# Altium schematic sheet VoltageSense.SchDoc
size A; SheetNumber: 5; SheetTotal: 5
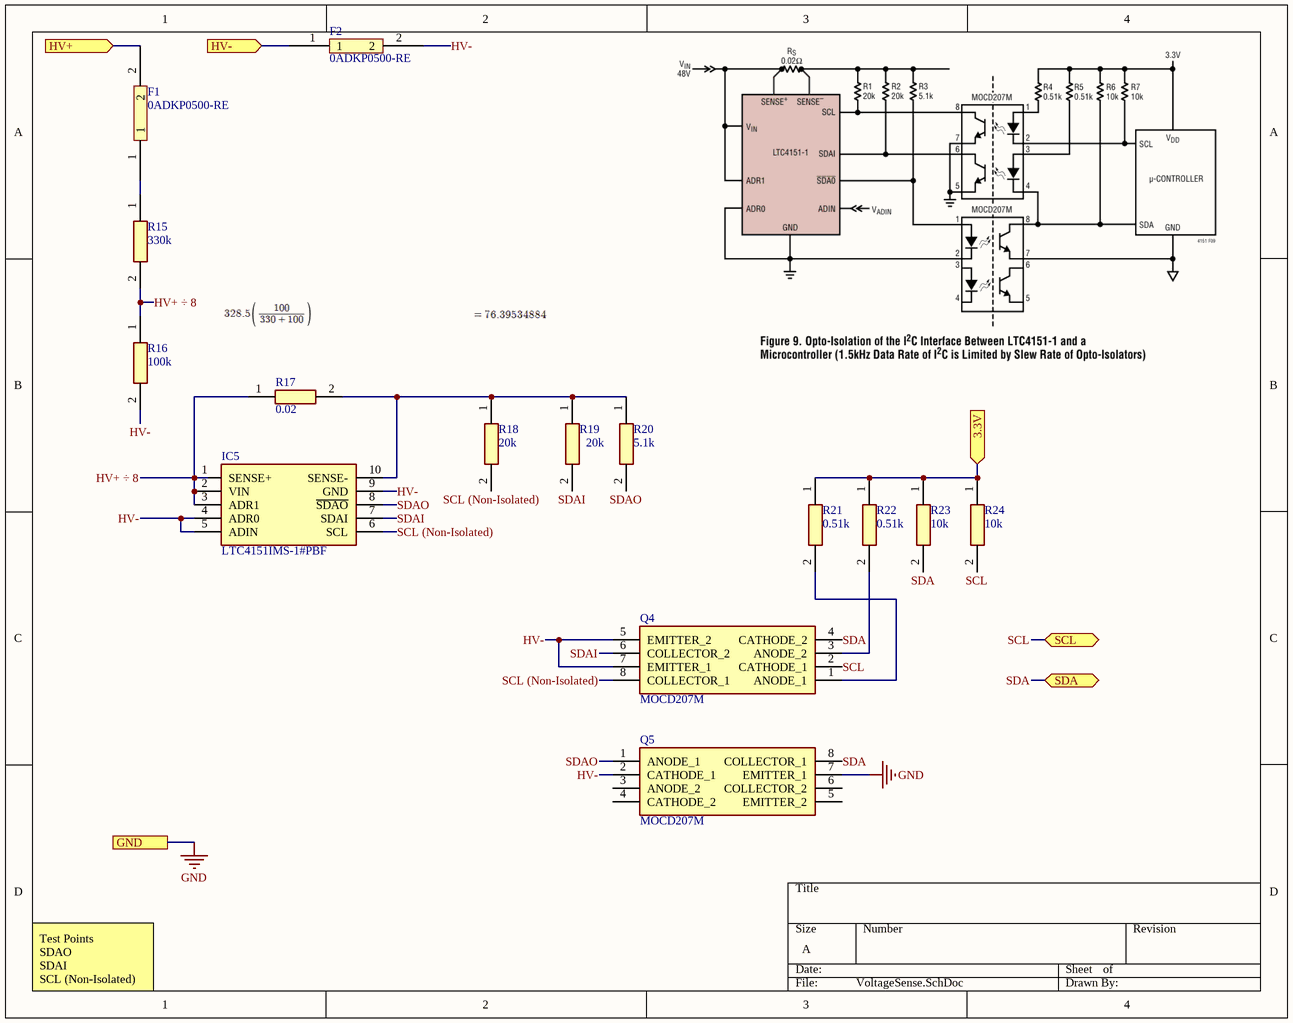
[diagram p0: VoltageSense.SchDoc]

## Parts
F1  0ADKP0500-RE  [0ADKP0500-RE]
F2  0ADKP0500-RE  [0ADKP0500-RE]
IC5  LTC4151IMS-1#PBF  [SOP50P490X110-10N]
Q4  MOCD207M  [SOIC127P594X363-8N]
Q5  MOCD207M  [SOIC127P594X363-8N]
R15  330k  [ERJP08_(1206)]
R16  100k  [RESC3216X65N]
R17  0.02  [RESC3216X68N]
R18  20k  [RESC3216X70N]
R19  20k  [RESC3216X70N]
R20  5.1k  [RESC3116X65N]
R21  0.51k  [RESC3216X65N]
R22  0.51k  [RESC3216X65N]
R23  10k  [ERJP08_(1206)]
R24  10k  [ERJP08_(1206)]

## Ports
3.3V (in), GND, HV+ (in), HV- (in), SCL (bidir), SDA (bidir)

## Nets
GND: Q5.7(EMITTER_1) ; port GND
3.3V: R21.1 R22.1 R23.1 R24.1 ; port 3.3V
HV+: F1.2 ; port HV+
HV+ ÷ 8: IC5.1(SENSE+) IC5.2(VIN) IC5.3(ADR1) R15.2 R16.1 R17.1
HV-: F2.2 IC5.4(ADR0) IC5.5(ADIN) IC5.9(GND) Q4.5(EMITTER_2) Q4.7(EMITTER_1) Q5.2(CATHODE_1) R16.2
HV-: F2.1 ; port HV-  [a separate net that carries the same name]
SCL: Q4.2(CATHODE_1) R24.2 ; port SCL
SCL (Non-Isolated): IC5.6(SCL) Q4.8(COLLECTOR_1) R18.2
SDA: Q4.4(CATHODE_2) Q5.8(COLLECTOR_1) R23.2 ; port SDA
SDAI: IC5.7(SDAI) Q4.6(COLLECTOR_2) R19.2
SDAO: IC5.8(~{SDAO}) Q5.1(ANODE_1) R20.2
NetF1_1: F1.1 R15.1
NetIC5_10: IC5.10(SENSE-) R17.2 R18.1 R19.1 R20.1
NetQ4_1: Q4.1(ANODE_1) R21.2
NetQ4_3: Q4.3(ANODE_2) R22.2

Not connected (* = marked no-connect by the designer): Q5 3(ANODE_2) 4(CATHODE_2) 5(EMITTER_2) 6(COLLECTOR_2)

## Notes on the sheet
- Test Points
  SDAO
  SDAI
  SCL (Non-Isolated)

## Library data of the parts
F1 F2 = 0ADKP0500-RE: Fuse
IC5 = LTC4151IMS-1#PBF: Integrated Circuit; Manufacturer_Name: Analog Devices; Datasheet Link: https://www.analog.com/media/en/technical-documentation/data-sheets/4151ff.pdf; Height: 1.1mm; Manufacturer_Part_Number: LTC4151IMS-1#PBF; Mouser Part Number: 584-LTC4151IMS-1#PBF; Mouser Price/Stock: https://www.mouser.co.uk/ProductDetail/Analog-Devices/LTC4151IMS-1PBF?qs=hVkxg5c3xu8GkocOuUpsIw%3D%3D; Arrow Part Number: LTC4151IMS-1#PBF; Arrow Price/Stock: https://www.arrow.com/en/products/ltc4151ims-1pbf/linear-technology
Q4 Q5 = MOCD207M: Transistor; Manufacturer_Name: onsemi; Datasheet Link: https://www.onsemi.com/pub/Collateral/MOCD217M-D.PDF; Height: 3.63mm; Manufacturer_Part_Number: MOCD207M; Mouser Part Number: 512-MOCD207M; Mouser Price/Stock: https://www.mouser.co.uk/ProductDetail/onsemi-Fairchild/MOCD207M?qs=Z0HAwyWrFkxA8A7IbmLQiA%3D%3D; Arrow Part Number: MOCD207M; Arrow Price/Stock: https://www.arrow.com/en/products/mocd207m/on-semiconductor?region=europe
R15 = ERJ-P08D3303V: Resistor; Manufacturer_Name: Panasonic; Datasheet Link: http://industrial.panasonic.com/cdbs/www-data/pdf/RDO0000/AOA0000C331.pdf; Height: 0.7mm; Manufacturer_Part_Number: ERJ-P08D3303V
R16 = MCA12060C1003FP500: Resistor; Manufacturer_Name: Vishay; Datasheet Link: https://componentsearchengine.com/Datasheets/1/MCA12060C1003FP500.pdf; Height: 0.65mm; Manufacturer_Part_Number: MCA12060C1003FP500; Mouser Part Number: 594-MCA12060C1003FP5; Mouser Price/Stock: https://www.mouser.com/Search/Refine.aspx?Keyword=594-MCA12060C1003FP5
R17 = PCS1206DR0200ET: Resistor; Manufacturer_Name: Ohmite; Datasheet Link: https://componentsearchengine.com/Datasheets/1/PCS1206DR0200ET.pdf; Height: 0.684mm; Manufacturer_Part_Number: PCS1206DR0200ET; Mouser Part Number: 588-PCS1206DR0200ET; Mouser Price/Stock: https://www.mouser.co.uk/ProductDetail/Ohmite/PCS1206DR0200ET?qs=Zz7%252BYVVL6bHe1REzh6xp%2Fw%3D%3D
R18 R19 = ERA-8APB203V: Resistor; Manufacturer_Name: Panasonic; Datasheet Link: https://industrial.panasonic.com/cdbs/www-data/pdf/RDM0000/AOA0000C307.pdf; Height: 0.7mm; Manufacturer_Part_Number: ERA-8APB203V; Mouser Part Number: 667-ERA-8APB203V; Mouser Price/Stock: https://www.mouser.co.uk/ProductDetail/Panasonic/ERA-8APB203V?qs=PgLP5AltfozIbJaoHBTq0Q%3D%3D
R20 = CRCW12065K10FKEAHP: Resistor; Manufacturer_Name: Vishay; Datasheet Link: http://componentsearchengine.com/Datasheets/1/CRCW12065K10FKEAHP.pdf; Height: 0.65mm; Manufacturer_Part_Number: CRCW12065K10FKEAHP; Mouser Part Number: 71-CRCW12065K10FKEAH; Mouser Price/Stock: https://www.mouser.co.uk/ProductDetail/Vishay-Dale/CRCW12065K10FKEAHP?qs=YmE2lSBYOPkBMGQxuoTowQ%3D%3D; Arrow Part Number: CRCW12065K10FKEAHP; Arrow Price/Stock: https://www.arrow.com/en/products/crcw12065k10fkeahp/vishay?region=nac
R21 R22 = KTR18EZPJ511: Resistor; Manufacturer_Name: ROHM Semiconductor; Datasheet Link: http://rohmfs.rohm.com/en/products/databook/datasheet/passive/resistor/chip_resistor/ktr.pdf; Height: 0.65mm; Manufacturer_Part_Number: KTR18EZPJ511; Mouser Part Number: 755-KTR18EZPJ511; Mouser Price/Stock: https://www.mouser.co.uk/ProductDetail/ROHM-Semiconductor/KTR18EZPJ511?qs=DyUWGjl%252BcVvm7MQRIM2yRQ%3D%3D
R23 R24 = ERJ-P08D1002V: Resistor; Manufacturer_Name: Panasonic; Datasheet Link: http://industrial.panasonic.com/cdbs/www-data/pdf/RDO0000/AOA0000C331.pdf; Height: 0.7mm; Manufacturer_Part_Number: ERJ-P08D1002V; Mouser Part Number: 667-ERJ-P08D1002V; Mouser Price/Stock: https://www.mouser.co.uk/ProductDetail/Panasonic/ERJ-P08D1002V?qs=iIVTEDlrHA2EA%252BOcRk4tPQ%3D%3D; Arrow Part Number: ERJ-P08D1002V; Arrow Price/Stock: https://www.arrow.com/en/products/erj-p08d1002v/panasonic